# EAGLE design 2 ZEGAR NIXIE (EAGLE 9.2.0)

## Sheet 1 of 2
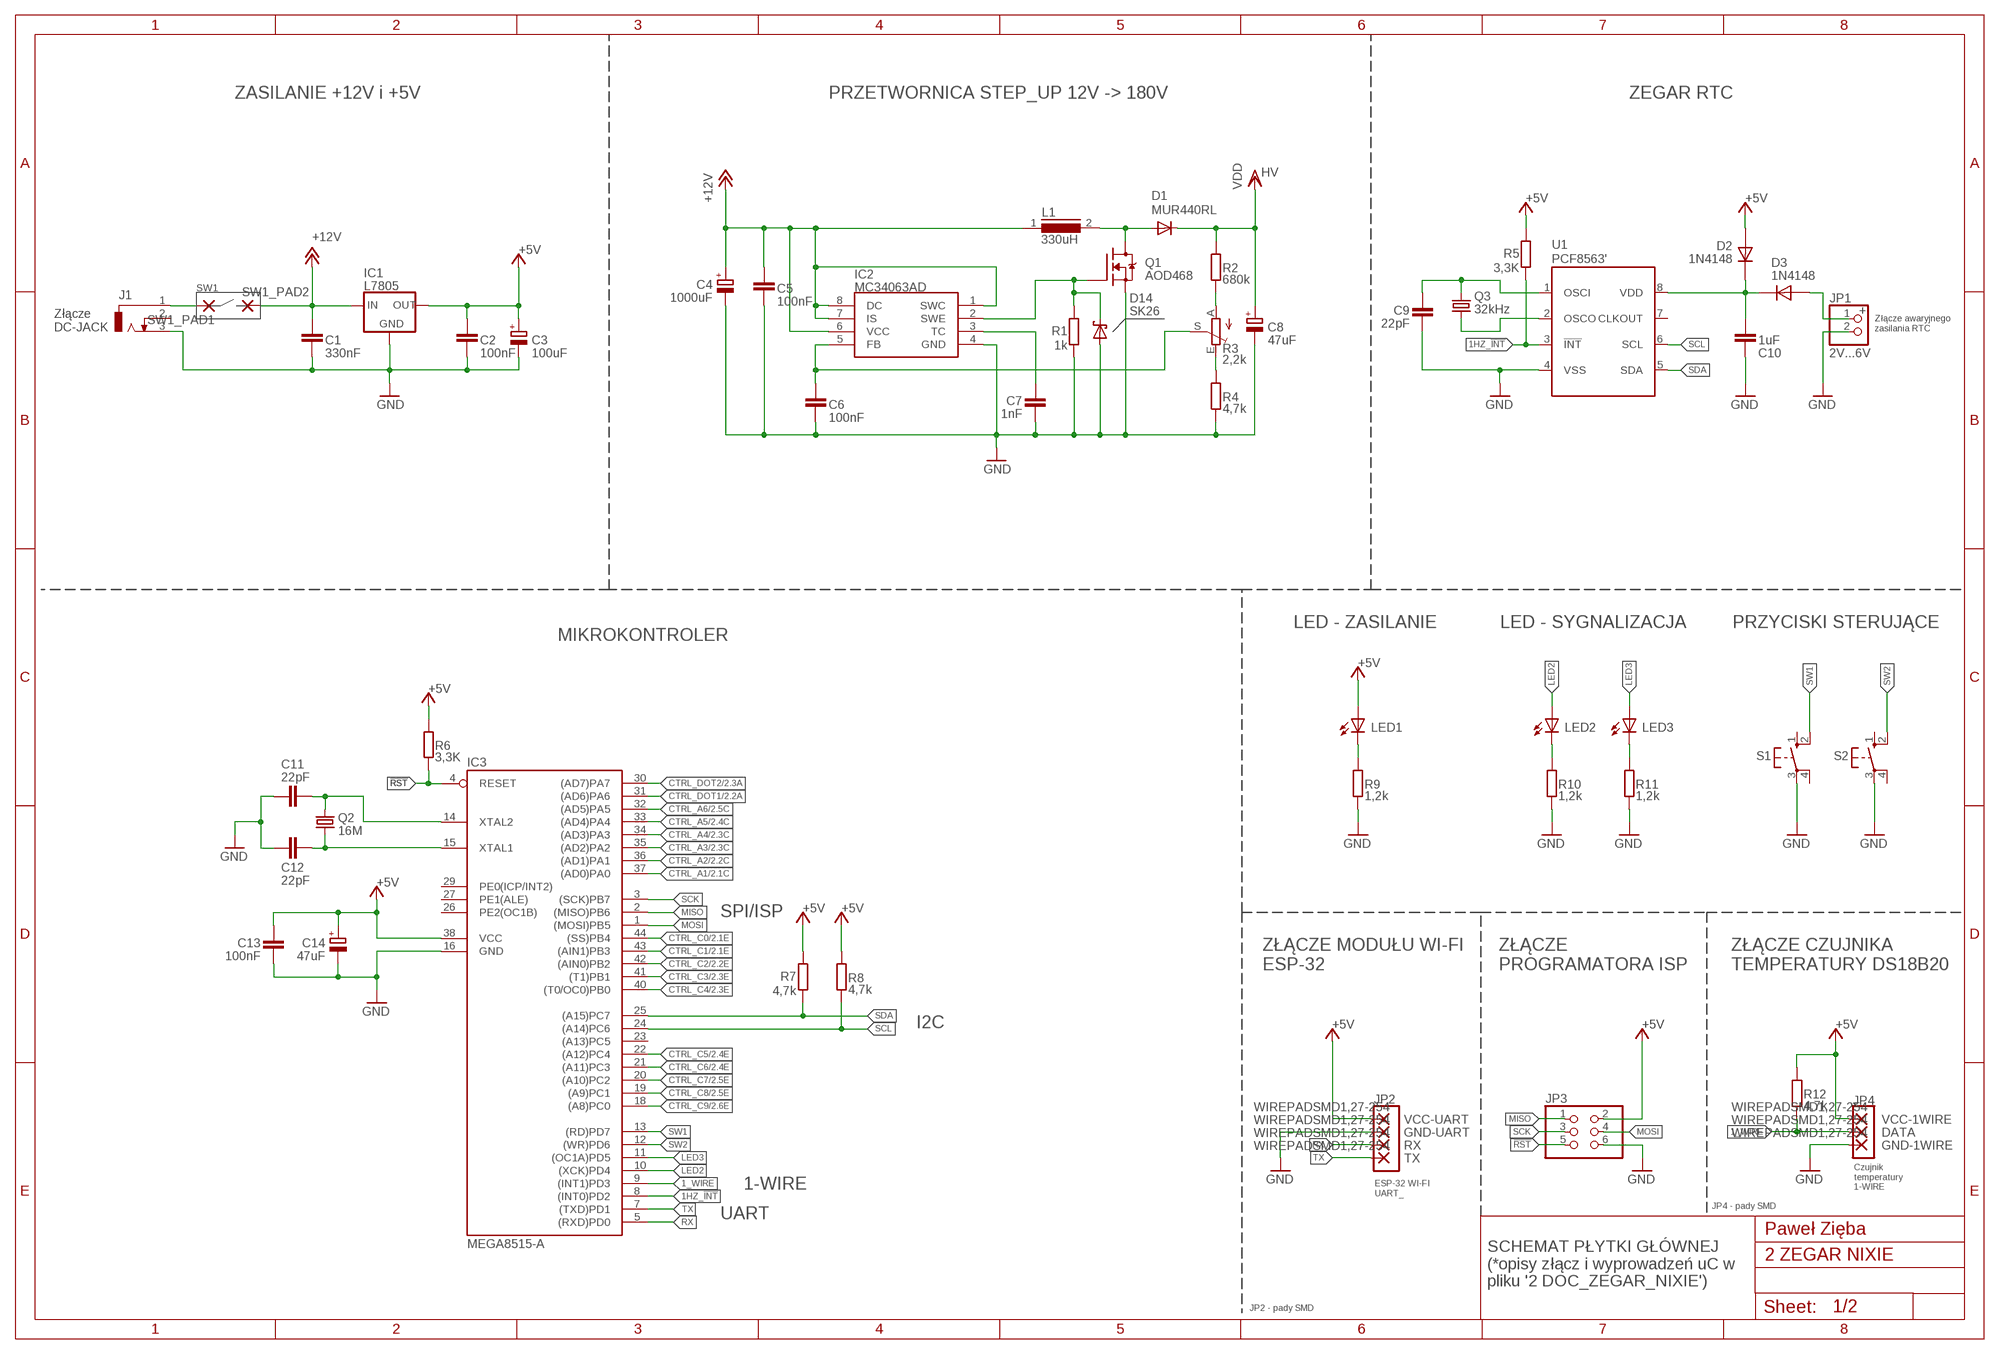
[diagram p0: schematic, sheet 1]

### Parts
C1  330nF  C-EUC1206  [C1206]
C2  100nF  C-EUC1206  [C1206]
C3  100uF  CPOL-EUE5-10.5  [E5-10,5]
C4  1000uF  CPOL-EUE5-10.5  [E5-10,5]
C5  100nF  C-EUC1206  [C1206]
C6  100nF  C-EUC1206  [C1206]
C7  1nF  C-EUC1206  [C1206]
C8  47uF  CPOL-EUE5-13  [E5-13]
C9  22pF  C-EUC1206  [C1206]
C10  1uF  C-EUC1206  [C1206]
C11  22pF  C-EUC1206  [C1206]
C12  22pF  C-EUC1206  [C1206]
C13  100nF  C-EUC1206  [C1206]
C14  47uF  CPOL-EUUD-6,3X8,8  [UD-6,3X5,8_NICHICON]
D1  MUR440RL  [C2673]
D2  1N4148  N14148'  [D1206]
D3  1N4148  N14148'  [D1206]
D14  SK26  SCHOTTKY-DIODESMD  [SMB]
DATA  WIREPADSMD1,27-254  [SMD1,27-2,54]
GND-1WIRE  WIREPADSMD1,27-254  [SMD1,27-2,54]
GND-UART  WIREPADSMD1,27-254  [SMD1,27-2,54]
IC1  L7805  L78-ST'  [DPAK]
IC2  MC34063AD  [SOIC8]
IC3  MEGA8515-A  [TQFP44]
J1  DCJ0303  [DCJ0303]
JP1  2V...6V  PINHD-1X2  [1X02]
JP3  PINHD-2X3  [2X03]
L1  330uH  SFT830D  [SFT830D]
LED1  LED_E  [LED_1206]
LED2  LED_E  [LED_1206]
LED3  LED_E  [LED_1206]
Q1  AOD468  [DPAK-TO252]
Q2  16M  KX-6  [2.5X2.0_KX-6]
Q3  32kHz  CRYSTALTC26H  [TC26H]
R1  1k  R-EU_R0805  [R0805]
R2  680k  R-EU_R0805  [R0805]
R3  2,2k  TRIM_EU-CA6V  [CA6V]
R4  4,7k  R-EU_R0805  [R0805]
R5  3,3K  R-EU_R1206  [R1206]
R6  3,3K  R-EU_R1206  [R1206]
R7  4,7k  R-EU_R1206  [R1206]
R8  4,7k  R-EU_R1206  [R1206]
R9  1,2k  R-EU_R1206  [R1206]
R10  1,2k  R-EU_R1206  [R1206]
R11  1,2k  R-EU_R1206  [R1206]
R12  4,7k  R-EU_R1206  [R1206]
RX  WIREPADSMD1,27-254  [SMD1,27-2,54]
S1  10-XX  [B3F-10XX]
S2  10-XX  [B3F-10XX]
SW1_PAD1  3,81/1,4  [3,81/1,4]
SW1_PAD2  3,81/1,4  [3,81/1,4]
TX  WIREPADSMD1,27-254  [SMD1,27-2,54]
U1  PCF8563'  [SO08-IRF]
VCC-1WIRE  WIREPADSMD1,27-254  [SMD1,27-2,54]
VCC-UART  WIREPADSMD1,27-254  [SMD1,27-2,54]

### Nets
1_WIRE: DATA.1(P) IC3.9((INT1)PD3) R12.1
1HZ_!INT: IC3.8((INT0)PD2) R5.1 U1.3(!INT)
!RST: IC3.4(RESET) JP3.5 R6.1
+5V: C2.1 C3.+ C13.2 C14.+ D2.1(+) IC1.3(OUT) IC3.38(VCC) JP3.2 LED1.A R5.2 R6.2 R7.2 R8.2 R12.2 VCC-1WIRE.1(P) VCC-UART.1(P)
+12V: C1.1 C4.+ C5.1 IC1.1(IN) IC2.1(SWC) IC2.6(VCC) IC2.7(IS) IC2.8(DC) L1.1 SW1_PAD2.1(P)
CTRL_A1: IC3.37((AD0)PA0) ; also sheet 2
CTRL_A2: IC3.36((AD1)PA1) ; also sheet 2
CTRL_A3: IC3.35((AD2)PA2) ; also sheet 2
CTRL_A4: IC3.34((AD3)PA3) ; also sheet 2
CTRL_A5: IC3.33((AD4)PA4) ; also sheet 2
CTRL_A6: IC3.32((AD5)PA5) ; also sheet 2
CTRL_C0: IC3.44((SS)PB4) ; also sheet 2
CTRL_C1: IC3.43((AIN1)PB3) ; also sheet 2
CTRL_C2: IC3.42((AIN0)PB2) ; also sheet 2
CTRL_C3: IC3.41((T1)PB1) ; also sheet 2
CTRL_C4: IC3.40((T0/OC0)PB0) ; also sheet 2
CTRL_C5: IC3.22((A12)PC4) ; also sheet 2
CTRL_C6: IC3.21((A11)PC3) ; also sheet 2
CTRL_C7: IC3.20((A10)PC2) ; also sheet 2
CTRL_C8: IC3.19((A9)PC1) ; also sheet 2
CTRL_C9: IC3.18((A8)PC0) ; also sheet 2
CTRL_DOT1: IC3.31((AD6)PA6) ; also sheet 2
CTRL_DOT2: IC3.30((AD7)PA7) ; also sheet 2
GND: C1.2 C2.2 C3.- C4.- C5.2 C6.2 C7.2 C8.- C9.2 C10.2 C11.1 C12.1 C13.1 C14.- D14.A GND-1WIRE.1(P) GND-UART.1(P) IC1.2(GND) IC2.4(GND) IC3.16(GND) J1.3 JP1.2 JP3.6 Q1.3(S) R1.1 R4.1 R9.1 R10.1 R11.1 S1.3(P) S2.3(P) U1.4(VSS) ; also sheet 2
HV: C8.+ D1.C R2.2 ; supply symbol labelled VDD ; also sheet 2
LED2: IC3.10((XCK)PD4) LED2.A
LED3: IC3.11((OC1A)PD5) LED3.A
MISO: IC3.2((MISO)PB6) JP3.1
MOSI: IC3.1((MOSI)PB5) JP3.4
N$23: J1.1 SW1_PAD1.1(P)
N$24: R2.1 R3.A
N$25: C7.1 IC2.3(TC)
N$26: R3.E R4.2
N$27: C11.2 IC3.14(XTAL2) Q2.3
N$28: D14.C IC2.2(SWE) Q1.1(G) R1.2
N$29: D1.A L1.2 Q1.2(D)
N$30: C6.1 IC2.5(FB) R3.S
N$36: LED1.C R9.2
N$38: C12.2 IC3.15(XTAL1) Q2.1
N$39: Q3.1 U1.2(OSCO)
N$40: C9.1 Q3.2 U1.1(OSCI)
N$41: C10.1 D2.2(-) D3.2(-) U1.8(VDD)
N$42: D3.1(+) JP1.1
N$48: LED2.C R10.2
N$49: LED3.C R11.2
RX: IC3.5((RXD)PD0) RX.1(P)
SCK: IC3.3((SCK)PB7) JP3.3
SCL: IC3.24((A14)PC6) R8.1 U1.6(SCL)
SDA: IC3.25((A15)PC7) R7.1 U1.5(SDA)
SW1: IC3.13((RD)PD7) S1.2(S1)
SW2: IC3.12((WR)PD6) S2.2(S1)
TX: IC3.7((TXD)PD1) TX.1(P)
Unconnected: IC3.6(NC1) IC3.17(NC2) IC3.23((A13)PC5) IC3.26(PE2(OC1B)) IC3.27(PE1(ALE)) IC3.28(NC3) IC3.29(PE0(ICP/INT2)) IC3.39(NC4) J1.2 S1.1(S) S1.4(P1) S2.1(S) S2.4(P1) U1.7(CLKOUT)

### Notes on the sheet
- ZASILANIE +12V i +5V | PRZETWORNICA STEP_UP 12V -> 180V | ZEGAR RTC
- SW1
- +
- Złącze
  DC-JACK
- Złącze awaryjnego
  zasilania RTC
- LED - ZASILANIE | LED - SYGNALIZACJA | PRZYCISKI STERUJĄCE
- MIKROKONTROLER
- SPI/ISP
- ZŁĄCZE MODUŁU WI-FI
  ESP-32
- ZŁĄCZE 
  PROGRAMATORA ISP
- ZŁĄCZE CZUJNIKA 
  TEMPERATURY DS18B20
- I2C
- JP2 | JP4
- 1-WIRE
- Czujnik
  temperatury
  1-WIRE
- ESP-32 WI-FI
  UART_
- JP4 - pady SMD
- UART
- Paweł Zięba
- SCHEMAT PŁYTKI GŁÓWNEJ 
  (*opisy złącz i wyprowadzeń uC w
  pliku '2 DOC_ZEGAR_NIXIE')
- JP2 - pady SMD

## Sheet 2 of 2
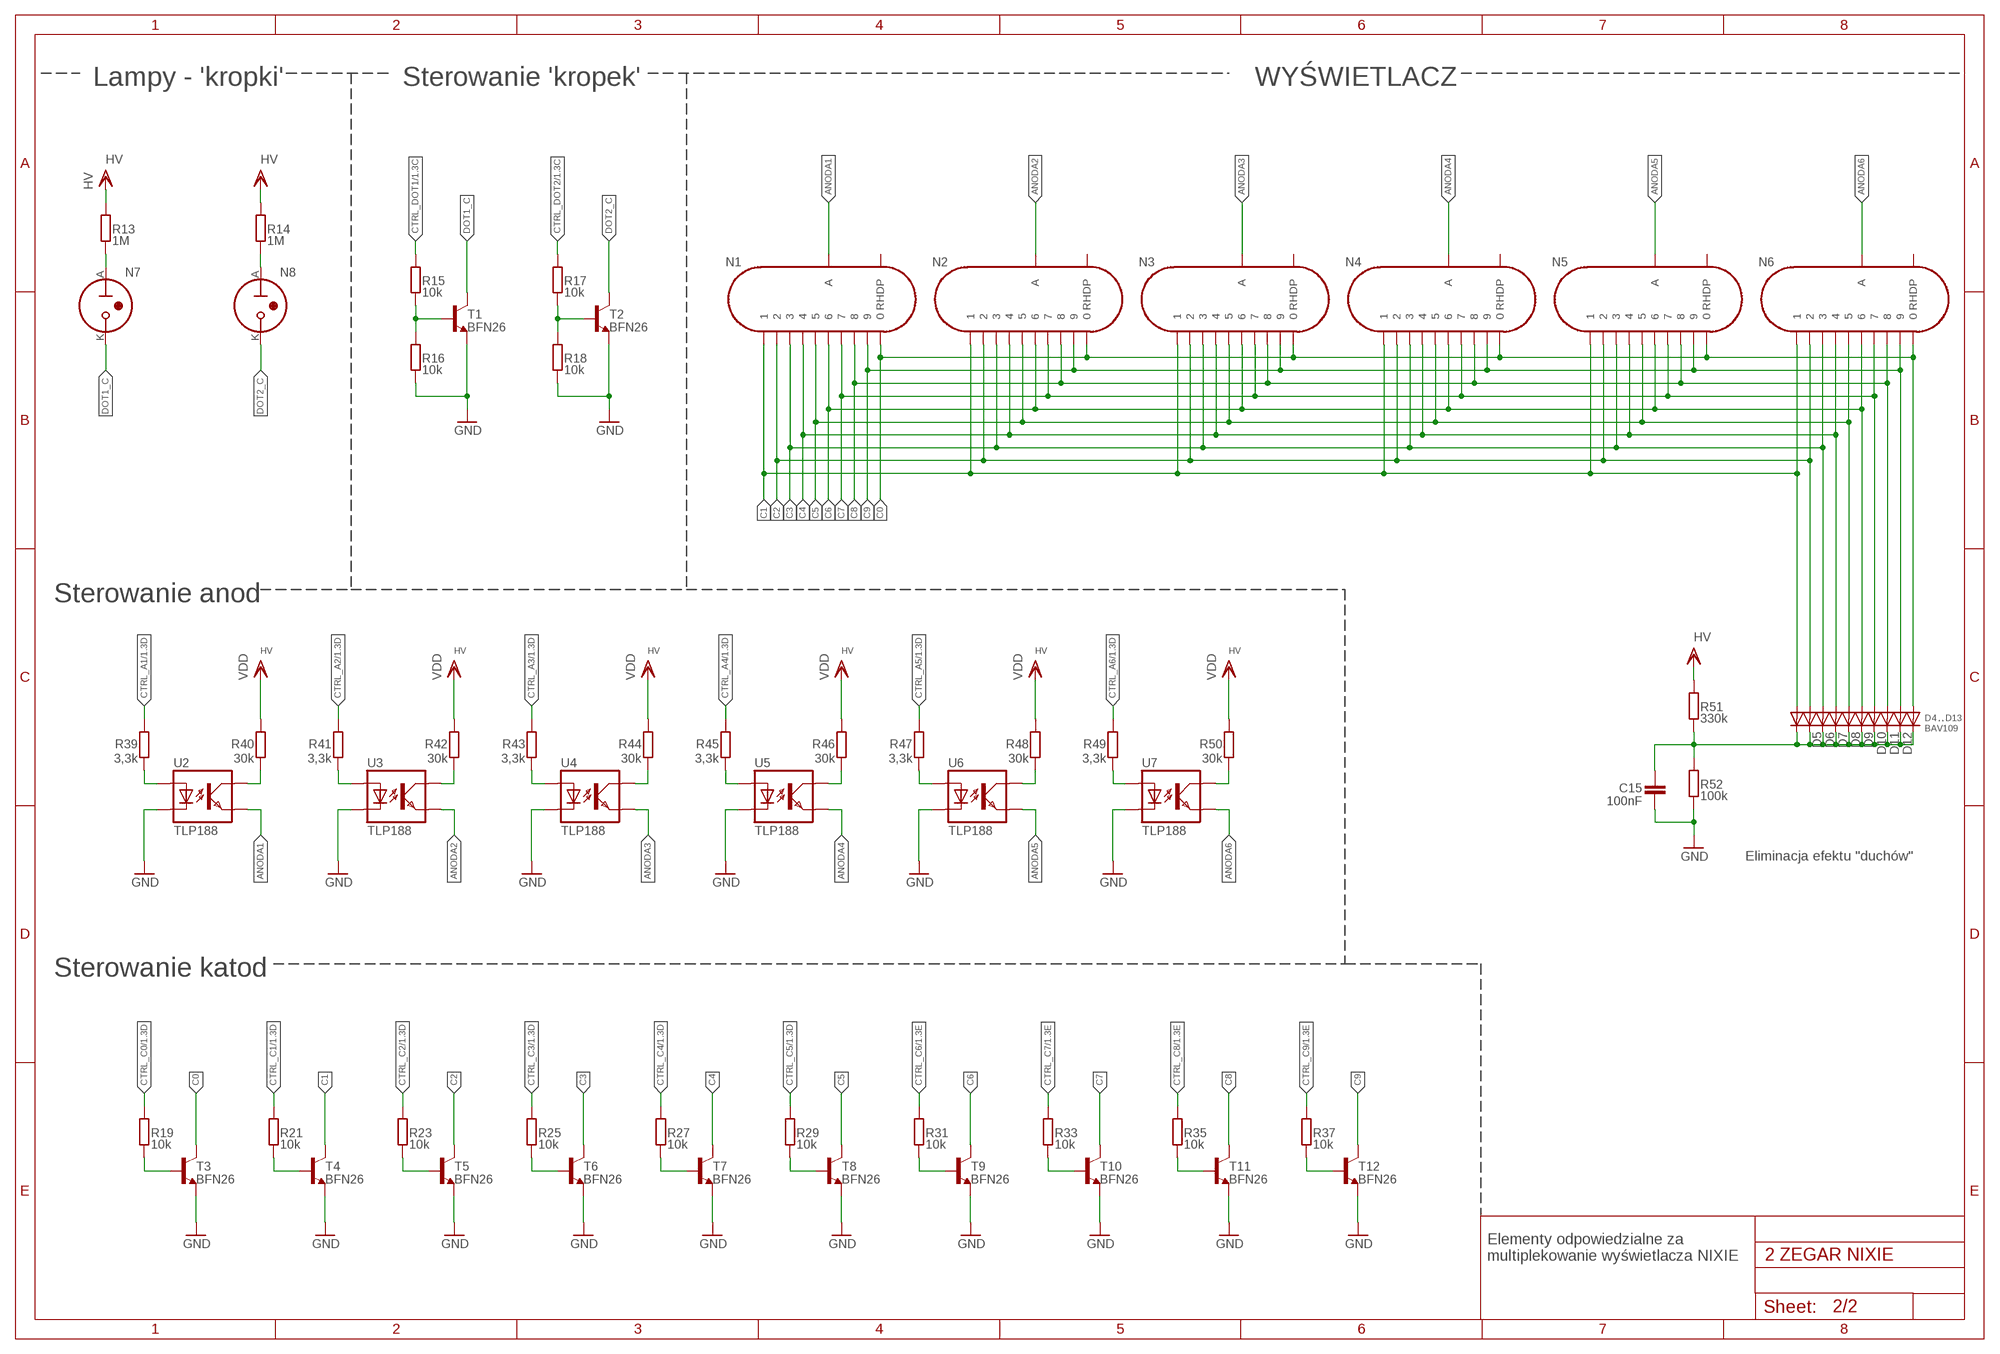
[diagram p1: schematic, sheet 2]

### Parts
C15  100nF  C-EUC1206  [C1206]
D4  DIODE-MINIMELF  [MINIMELF]
D5  DIODE-MINIMELF  [MINIMELF]
D6  DIODE-MINIMELF  [MINIMELF]
D7  DIODE-MINIMELF  [MINIMELF]
D8  DIODE-MINIMELF  [MINIMELF]
D9  DIODE-MINIMELF  [MINIMELF]
D10  DIODE-MINIMELF  [MINIMELF]
D11  DIODE-MINIMELF  [MINIMELF]
D12  DIODE-MINIMELF  [MINIMELF]
D13  BAV109  DIODE-MINIMELF  [MINIMELF]
N1  IN-8-2  [IN-8-2]
N2  IN-8-2  [IN-8-2]
N3  IN-8-2  [IN-8-2]
N4  IN-8-2  [IN-8-2]
N5  IN-8-2  [IN-8-2]
N6  IN-8-2  [IN-8-2]
N7  IN-3  [IN-3]
N8  IN-3  [IN-3]
R13  1M  R-EU_R1206  [R1206]
R14  1M  R-EU_R1206  [R1206]
R15  10k  R-EU_R0805  [R0805]
R16  10k  R-EU_R0805  [R0805]
R17  10k  R-EU_R0805  [R0805]
R18  10k  R-EU_R0805  [R0805]
R19  10k  R-EU_R0805  [R0805]
R21  10k  R-EU_R0805  [R0805]
R23  10k  R-EU_R0805  [R0805]
R25  10k  R-EU_R0805  [R0805]
R27  10k  R-EU_R0805  [R0805]
R29  10k  R-EU_R0805  [R0805]
R31  10k  R-EU_R0805  [R0805]
R33  10k  R-EU_R0805  [R0805]
R35  10k  R-EU_R0805  [R0805]
R37  10k  R-EU_R0805  [R0805]
R39  3,3k  R-EU_R0805  [R0805]
R40  30k  R-EU_R1206  [R1206]
R41  3,3k  R-EU_R0805  [R0805]
R42  30k  R-EU_R1206  [R1206]
R43  3,3k  R-EU_R0805  [R0805]
R44  30k  R-EU_R1206  [R1206]
R45  3,3k  R-EU_R0805  [R0805]
R46  30k  R-EU_R1206  [R1206]
R47  3,3k  R-EU_R0805  [R0805]
R48  30k  R-EU_R1206  [R1206]
R49  3,3k  R-EU_R0805  [R0805]
R50  30k  R-EU_R1206  [R1206]
R51  330k  R-EU_R1206  [R1206]
R52  100k  R-EU_R1206  [R1206]
T1  BFN26  BC850SMD  [SOT23-BEC]
T2  BFN26  BC850SMD  [SOT23-BEC]
T3  BFN26  BC850SMD  [SOT23-BEC]
T4  BFN26  BC850SMD  [SOT23-BEC]
T5  BFN26  BC850SMD  [SOT23-BEC]
T6  BFN26  BC850SMD  [SOT23-BEC]
T7  BFN26  BC850SMD  [SOT23-BEC]
T8  BFN26  BC850SMD  [SOT23-BEC]
T9  BFN26  BC850SMD  [SOT23-BEC]
T10  BFN26  BC850SMD  [SOT23-BEC]
T11  BFN26  BC850SMD  [SOT23-BEC]
T12  BFN26  BC850SMD  [SOT23-BEC]
U2  TLP188  [11-4M1S]
U3  TLP188  [11-4M1S]
U4  TLP188  [11-4M1S]
U5  TLP188  [11-4M1S]
U6  TLP188  [11-4M1S]
U7  TLP188  [11-4M1S]

### Nets
ANODA1: N1.A U2.P$4(EMIT)
ANODA2: N2.A U3.P$4(EMIT)
ANODA3: N3.A U4.P$4(EMIT)
ANODA4: N4.A U5.P$4(EMIT)
ANODA5: N5.A U6.P$4(EMIT)
ANODA6: N6.A U7.P$4(EMIT)
C0: D13.A N1.0 N2.0 N3.0 N4.0 N5.0 N6.0 T3.C
C1: D4.A N1.1 N2.1 N3.1 N4.1 N5.1 N6.1 T4.C
C2: D5.A N1.2 N2.2 N3.2 N4.2 N5.2 N6.2 T5.C
C3: D6.A N1.3 N2.3 N3.3 N4.3 N5.3 N6.3 T6.C
C4: D7.A N1.4 N2.4 N3.4 N4.4 N5.4 N6.4 T7.C
C5: D8.A N1.5 N2.5 N3.5 N4.5 N5.5 N6.5 T8.C
C6: D9.A N1.6 N2.6 N3.6 N4.6 N5.6 N6.6 T9.C
C7: D10.A N1.7 N2.7 N3.7 N4.7 N5.7 N6.7 T10.C
C8: D11.A N1.8 N2.8 N3.8 N4.8 N5.8 N6.8 T11.C
C9: D12.A N1.9 N2.9 N3.9 N4.9 N5.9 N6.9 T12.C
CTRL_A1: R39.1 ; also sheet 1
CTRL_A2: R41.1 ; also sheet 1
CTRL_A3: R43.1 ; also sheet 1
CTRL_A4: R45.1 ; also sheet 1
CTRL_A5: R47.1 ; also sheet 1
CTRL_A6: R49.1 ; also sheet 1
CTRL_C0: R19.2 ; also sheet 1
CTRL_C1: R21.2 ; also sheet 1
CTRL_C2: R23.2 ; also sheet 1
CTRL_C3: R25.2 ; also sheet 1
CTRL_C4: R27.2 ; also sheet 1
CTRL_C5: R29.2 ; also sheet 1
CTRL_C6: R31.2 ; also sheet 1
CTRL_C7: R33.2 ; also sheet 1
CTRL_C8: R35.2 ; also sheet 1
CTRL_C9: R37.2 ; also sheet 1
CTRL_DOT1: R15.2 ; also sheet 1
CTRL_DOT2: R17.2 ; also sheet 1
DOT1_C: N7.K T1.C
DOT2_C: N8.K T2.C
GND: C15.2 R16.1 R18.1 R52.1 T1.E T2.E T3.E T4.E T5.E T6.E T7.E T8.E T9.E T10.E T11.E T12.E U2.P$3(C) U3.P$3(C) U4.P$3(C) U5.P$3(C) U6.P$3(C) U7.P$3(C) ; also sheet 1
HV: R13.2 R14.2 R40.2 R42.2 R44.2 R46.2 R48.2 R50.2 R51.2 ; supply symbol labelled VDD ; also sheet 1
N$37: C15.1 D4.C D5.C D6.C D7.C D8.C D9.C D10.C D11.C D12.C D13.C R51.1 R52.2
N$43: N7.A R13.1
N$44: N8.A R14.1
N$45: R15.1 R16.2 T1.B
N$46: R17.1 R18.2 T2.B
N$47: R40.1 U2.P$6(COL)
N$50: R42.1 U3.P$6(COL)
N$51: R44.1 U4.P$6(COL)
N$52: R46.1 U5.P$6(COL)
N$53: R48.1 U6.P$6(COL)
N$54: R50.1 U7.P$6(COL)
N$55: R39.2 U2.P$1(A)
N$56: R41.2 U3.P$1(A)
N$57: R43.2 U4.P$1(A)
N$58: R49.2 U7.P$1(A)
N$59: R47.2 U6.P$1(A)
N$60: R45.2 U5.P$1(A)
N$61: R19.1 T3.B
N$62: R21.1 T4.B
N$63: R23.1 T5.B
N$64: R25.1 T6.B
N$65: R27.1 T7.B
N$66: R29.1 T8.B
N$67: R31.1 T9.B
N$68: R33.1 T10.B
N$69: R35.1 T11.B
N$70: R37.1 T12.B
Unconnected: N1..(RHDP) N2..(RHDP) N3..(RHDP) N4..(RHDP) N5..(RHDP) N6..(RHDP)

### Notes on the sheet
- Lampy - 'kropki' | Sterowanie 'kropek' | WYŚWIETLACZ
- Sterowanie anod
- ..
- Eliminacja efektu "duchów"
- Sterowanie katod
- Elementy odpowiedzialne za 
  multiplekowanie wyświetlacza NIXIE

## Library data of the parts
C1 C2 C5-C7 C9-C13 C15 = rcl:C-EU: CAPACITOR, European symbol; SPICEPREFIX: C
C3 C4 C8 C14 = rcl:CPOL-EU: POLARIZED CAPACITOR, European symbol; SPICEPREFIX: C
D1 = diode:MUR440RL: DIODE ultra-fast recovery rectifier, Vrrm = 40 V, 4 A
D2 D3 = Diody, mostki:N14148
D4-D13 = diode:DIODE-: DIODE
D14 = diode:SCHOTTKY-DIODE: Schottky Diode
DATA GND-1WIRE GND-UART RX TX VCC-1WIRE VCC-UART = wirepad:WIREPAD: Wire PAD connect wire on PCB
IC1 = stabilizatory_regulatory:L78-ST
IC2 = mc34063:MC34063
IC3 = atmel:MEGA8515: MICROCONTROLLER 8 Kbytes FLASH 512 bytes SRAM 512 bytes EEPROM USART 8-channel 10 bit ADC Source: avr.lbr; MPN: ATMEGA8515-16AU; OC_FARNELL: 9171410; OC_NEWARK: 01M6904
J1 = con-jack:DCJ0303: DC POWER JACK Source: DCJ0303.pdf; OC_FARNELL: unknown; OC_NEWARK: unknown
JP1 = pinhead:PINHD-1X2: PIN HEADER
JP3 = pinhead:PINHD-2X3: PIN HEADER
L1 = inductors:SFT830D: INDUCTOR; SPICEPREFIX: L
LED1-LED3 = eagle-ltspice:LED_E: LED Source: http://www.osram.convergy.de Source: www.luxeon.com Source: www.kingbright.com; SPICEMODEL: NONE; SPICEPREFIX: D; SPICETYPE: diode
N1-N6 = russian-nixies:IN-8-2: IN-8-2: medium numeric frontview nixie tube
N7 N8 = russian-nixies:IN-3: IN-3: nixie bulb
Q1 = tranzystory:AOD468
Q2 = crystal-geyer_V1_0:KX: Quartz Crystals (MHz) SMD: KX - Serie Model Size l/w/h [mm] Frequency Range Frequency Stability Temp. Range [°C] Load Capacitance AECQ 200 availabel Datasheet KX-4 KX-5 KX-6 KX-7 KX-9A KX-9B KX-12A KX-12B KX-13 KX-20 KX-K KX-KS 1.6/1.2/0.3 2.0/1.6/0.45 2.5/2.0/0.55 3.2/2.5/0.8 5.0/3.2/1.0 5.0/3.2/1.1 6.0/3.5/1.1 6.0/3.5/1.0 7.0/5.0 /1.3 11.6/5.5/1.6 12.3/4.5/4.2 12.3/4.5/3.2 24.0 ~ 80.0 MHz 16.0 ~ 80.0 MHz 12.0 ~ 80.0 MHz 8.0 ~ 60.0 MHz 7,68 ~ 300,0 MHz 8,0 ~ 50,0 MHz 8,0 ~ 150,0 MHz 8,0 ~ 50,0 MHz 6,0 ~ 160,0 MHz 3,579 ~ 25,0 MHz 3,579 ~ 70,0 MHz 3,579 ~ 70,0 MHz ±10 … ±50ppm ±10 … ±50ppm ±10 … ±50ppm ±10 … ±50ppm ±10 … ±50ppm ±10 … ±50ppm ±10 … ±50ppm ±10 … ±50ppm ±10 … ±50ppm ±50ppm ±10 … ±50ppm ±10 … ±50ppm (*) -40°C …+85°C (*) -40°C …+125°C (*) -40°C …+125°C (*) -40°C …+125°C (*) -40°C …+105°C (*) -40°C …+105°C (*) -40°C …+125°C (*) -40°C …+105°C (*) -40°C …+105°C (*) -40°C …+105°C (*) -40°C …+85°C (*) -40°C …+85°C 8, 8…16 8, 8…16 10, 8…16 12, 7…20 16, 10…20 16, 10…20 16, 10…20 16, 12…20 16, 12…20 16, 12…20 16, 12…30 16, 12…30 - yes yes yes - - - - - - - - KX-4.pdf <http://www.geyer-electronic.de/uploads/tx_userartikelfrequenz/GEYER-KX-4.pdf> KX-5.pdf <http://www.geyer-electronic.de/uploads/tx_userartikelfrequenz/GEYER-KX-5.pdf> KX-6.pdf <http://www.geyer-electronic.de/uploads/tx_userartikelfrequenz/GEYER-KX-6.pdf> KX-7.pdf <http://www.geyer-electronic.de/uploads/tx_userartikelfrequenz/GEYER-KX-7.pdf> KX-9A.pdf <http://www.geyer-electronic.de/uploads/tx_userartikelfrequenz/GEYER-KX-9A.pdf> KX-9B.pdf <http://www.geyer-electronic.de/uploads/tx_userartikelfrequenz/GEYER-KX-9B.pdf> KX-12A.pdf <http://www.geyer-electronic.de/uploads/tx_userartikelfrequenz/GEYER-KX-12A.pdf> KX-12B.pdf <http://www.geyer-electronic.de/uploads/tx_userartikelfrequenz/GEYER-KX-12B.pdf> KX-13.pdf <http://www.geyer-electronic.de/uploads/tx_userartikelfrequenz/GEYER-KX-13.pdf> KX-20.pdf <http://www.geyer-electronic.de/uploads/tx_userartikelfrequenz/GEYER-KX-20.pdf> KX-K.pdf <http://www.geyer-electronic.de/uploads/tx_userartikelfrequenz/GEYER-KX-K.pdf> KX-KS.pdf <http://www.geyer-electronic.de/uploads/tx_userartikelfrequenz/GEYER-KX-KS.pdf> <http://www.geyer-electronic.de/fileadmin/template/img/logo-geyer-electronic.png> Details see: http://www.geyer-electronic.de/Frequenz-Produkte.9.0.html Created 2016-06-07, Hans Locher 2016 (C) Geyer Quartz Technology KX4,KX5,KX6,KX7,KX9A,KX9B,KX12A,KX12B,KX13,KX20,KXK,KXKS;1612;2016;2520;3225;5032;6035;7050;11655;12345;1,6x1,2;2,0x1,6;2,5x2,0;3,2x2,5;5,0x3,2;6,0x3,5;7,0x5,0;11,6x5,5;12,3x4,5;12,3x4,5;1.6x1.2;2.0x1.6;2.5x2.0;3.2x2.5;5.0x3.2;6.0x3.5;7.0x5.0;11.6x5.5;12.3x4.5;12.3x4.5;
Q3 = crystal:CRYSTAL: CRYSTAL; OC_FARNELL: unknown; OC_NEWARK: unknown
R1 R2 R4-R19 R21 R23 R25 R27 R29 R31 R33 R35 R37 R39-R52 = rcl:R-EU_: RESISTOR, European symbol; SPICEPREFIX: R
R3 = pot:TRIM_EU-: POTENTIOMETER
S1 S2 = switch-omron:10-XX: OMRON SWITCH; MPN: B3F-1000; OC_FARNELL: 176432; OC_NEWARK: 36M3542
SW1_PAD1 SW1_PAD2 = wirepad:3,81/1,4: THROUGH-HOLE PAD
T1-T12 = transistor-npn:BC850*: NPN Transistor
U1 = Układy_scalone:PCF8563
U2-U7 = opto:TLP188

## Board
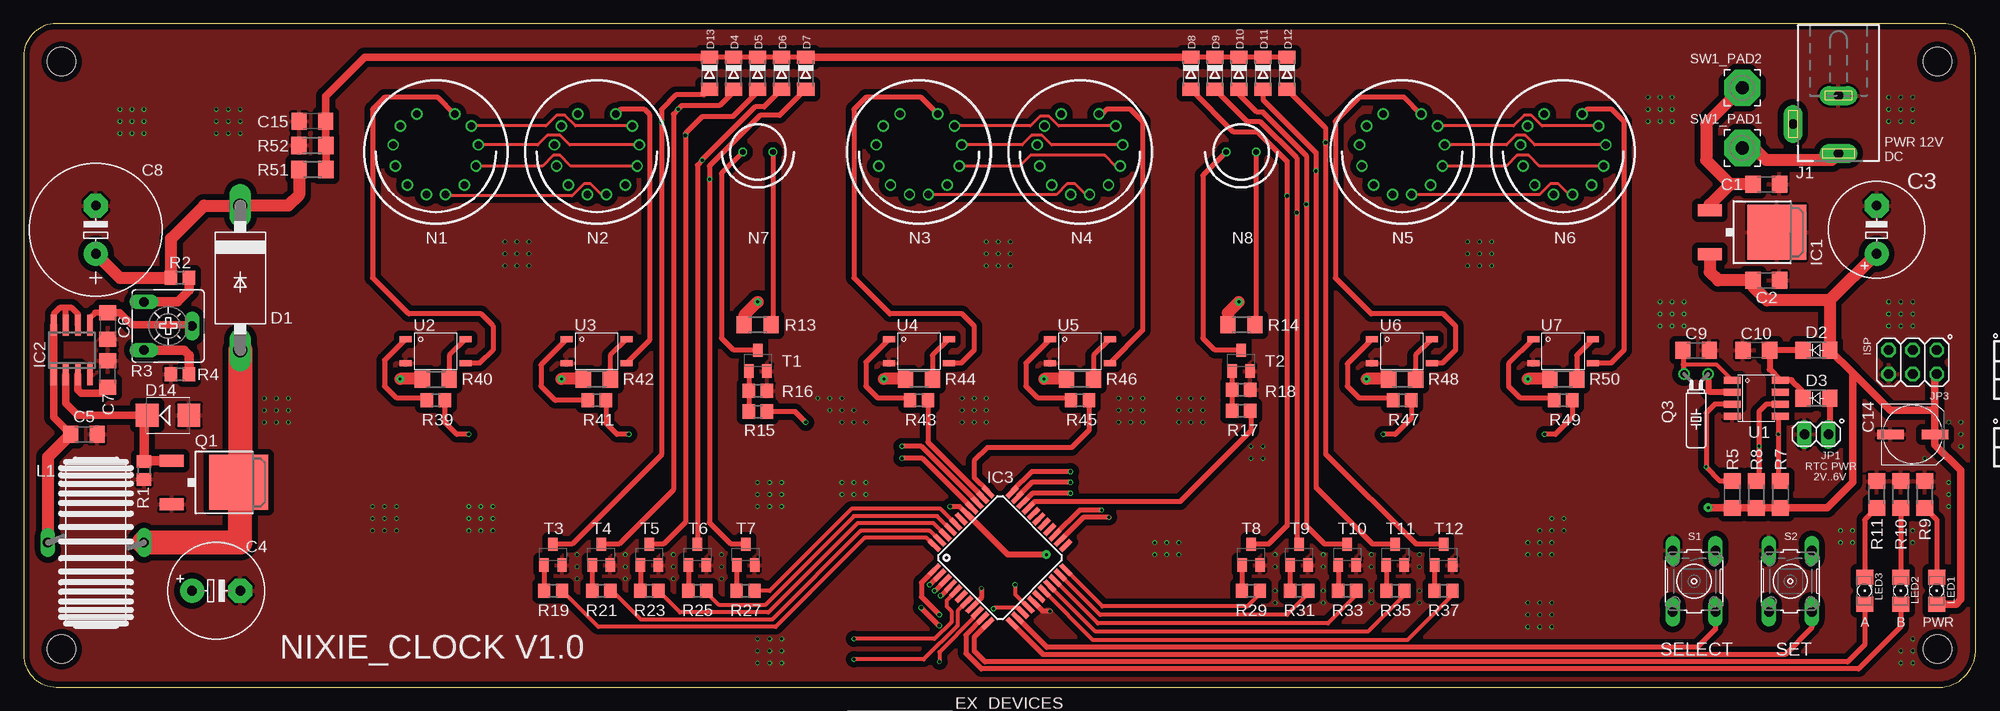
[diagram p2: board, top side]
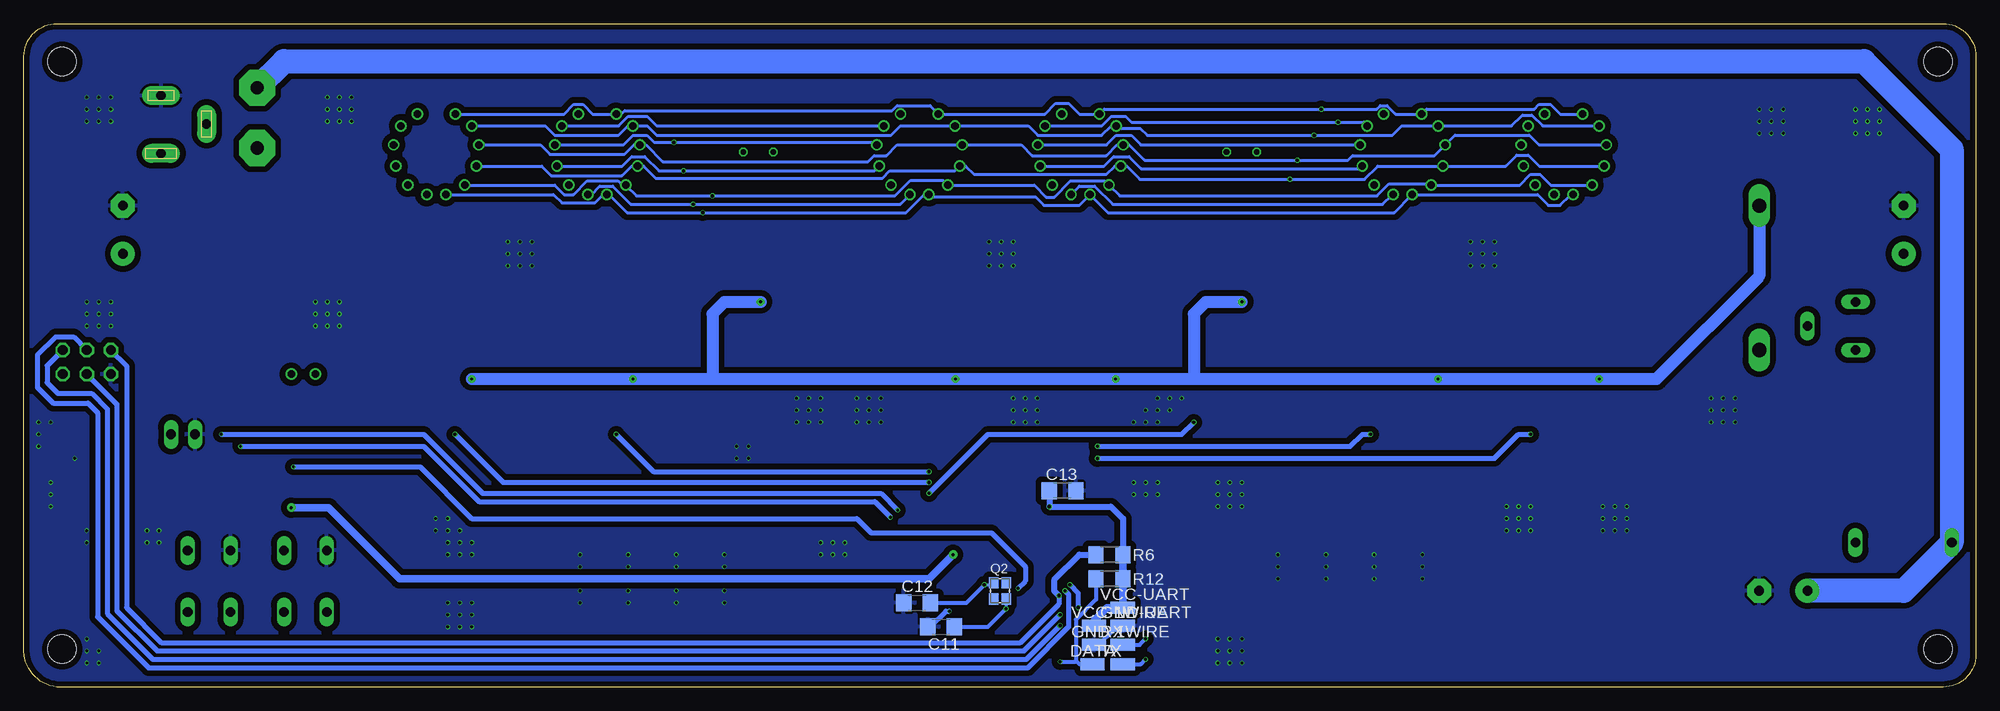
[diagram p3: board, bottom side, seen from below]

Size 206.05 x 70 mm. Coordinates in mm from the lower left corner, seen from the top.
Outline: 0,66.59 0,3.41 arc90 3.41,0 202.57,0 arc90 206.02,4.45 206.02,66.55 arc90 202.57,70 3.41,70 arc90 0,66.59
Copper layers (1*16): Top 0.035559375mm / dielectric 1.6mm / Bottom 0.035559375mm
Design rules "jlcpcb2layer": minimum track width 5mil, minimum drill 12mil, track to track 5mil, track to pad 5mil, pad to pad 5mil, via to via 5mil, smd to smd 5mil, copper to edge 8mil, drill to drill 6mil, minimum pad ring 5mil, minimum via ring 3mil, stop-mask expansion 2.5mil, vias tented up to drill 0mil, thermal gap 10mil
Holes 3 mm at 4,66 4,4 202,4 202,66

### Footprints (pad centres in the part's own frame; a part is rotated, then mirrored left to right if it is on the bottom)
C1206 = smd 1.6 x 1.8: 1 -1.4,0; 2 1.4,0
E5-10,5 = drill 1.016 pad 2.54: + -2.54,0 | drill 1.016 pad 2.54 octagon: - 2.54,0
E5-13 = drill 1.016 pad 2.54: + -2.54,0 | drill 1.016 pad 2.54 octagon: - 2.54,0
UD-6,3X5,8_NICHICON = smd 2.8 x 1: + 2.35,0; - -2.35,0
C2673 = drill 1.499 long: A 7.62,0; C -7.62,0
D1206 = smd 1.6 x 1.803: 1 -1.422,0; 2 1.422,0
MINIMELF = smd 1.4 x 1.8: A 1.7,0; C -1.7,0
SMB = smd 2.4 x 2.4: A 2.2,0; C -2.2,0
SMD1,27-2,54 = smd 1.27 x 2.54: 1 0,0
DPAK = smd 1.27 x 2.54: 1 -2.312,-4.693; 3 2.312,-4.693 | smd 5.8 x 6.2: 2 0,2.38
SOIC8 = smd 0.6 x 2.2: 1 -1.905,-2.6; 2 -0.635,-2.6; 3 0.635,-2.6; 4 1.905,-2.6; 5 1.905,2.6; 6 0.635,2.6; 7 -0.635,2.6; 8 -1.905,2.6
TQFP44 = smd 1.5 x 0.5: 1 -5.8,4; 2 -5.8,3.2; 3 -5.8,2.4; 4 -5.8,1.6; 5 -5.8,0.8; 6 -5.8,0; 7 -5.8,-0.8; 8 -5.8,-1.6; 9 -5.8,-2.4; 10 -5.8,-3.2; 11 -5.8,-4; 23 5.8,-4; 24 5.8,-3.2; 25 5.8,-2.4; 26 5.8,-1.6; 27 5.8,-0.8; 28 5.8,0; 29 5.8,0.8; 30 5.8,1.6; 31 5.8,2.4; 32 5.8,3.2; 33 5.8,4 | smd 0.5 x 1.5: 12 -4,-5.8; 13 -3.2,-5.8; 14 -2.4,-5.8; 15 -1.6,-5.8; 16 -0.8,-5.8; 17 0,-5.8; 18 0.8,-5.8; 19 1.6,-5.8; 20 2.4,-5.8; 21 3.2,-5.8; 22 4,-5.8; 34 4,5.8; 35 3.2,5.8; 36 2.4,5.8; 37 1.6,5.8; 38 0.8,5.8; 39 0,5.8; 40 -0.8,5.8; 41 -1.6,5.8; 42 -2.4,5.8; 43 -3.2,5.8; 44 -4,5.8
DCJ0303 = drill 1 pad 2 long: 1 0,3.1; 2 4.8,0; 3 0,-3
1X02 = drill 1.016 long: 1 -1.27,0; 2 1.27,0
2X03 = drill 1.016 octagon: 1 -2.54,-1.27; 2 -2.54,1.27; 3 0,-1.27; 4 0,1.27; 5 2.54,-1.27; 6 2.54,1.27
SFT830D = drill 1.016 long: 1 -5.08,0; 2 5.08,0
LED_1206 = smd 1.6 x 1.803: A -1.422,0; C 1.422,0
IN-8-2 = drill 0.8: 0 -3.75,-2.75; 1 2,-4; 2 3.75,-2.75; 3 4.5,-0.75; 4 4.25,1.5; 5 3,3.5; 6 1,4.5; 7 -1,4.5; 8 -4.25,1.5; 9 -4.5,-0.75; . -3,3.5; A -2,-4
IN-3 = drill 0.6 octagon: A -1.587,0; K 1.587,0
DPAK-TO252 = smd 1.27 x 2.54: 1 -2.312,-4.693; 3 2.312,-4.693 | smd 5.8 x 6.2: 2 0,2.38
2.5X2.0_KX-6 = smd 1.2 x 1: 1 -0.85,-0.65; 2 0.85,-0.65; 3 0.85,0.65; 4 -0.85,0.65
TC26H = drill 0.813: 1 -1.27,0; 2 1.27,0
R0805 = smd 1.3 x 1.5: 1 -0.95,0; 2 0.95,0
CA6V = drill 1.016 long: A -2.54,-2.54; E 2.54,-2.54; S 0,2.54
R1206 = smd 1.6 x 1.803: 1 -1.422,0; 2 1.422,0
B3F-10XX = drill 1.016 long: 1 -3.251,2.261; 2 3.251,2.261; 3 -3.251,-2.261; 4 3.251,-2.261
3,81/1,4 = drill 1.397 pad 3.81 octagon: 1 0,0
SOT23-BEC = smd 1 x 1.4: B -0.95,-1.1; C 0,1.1; E 0.95,-1.1
SO08-IRF = smd 0.72 x 1.78: 1 -1.905,-2.543; 2 -0.635,-2.543; 3 0.635,-2.543; 4 1.905,-2.543; 5 1.905,2.543; 6 0.635,2.543; 7 -0.635,2.543; 8 -1.905,2.543
11-4M1S = smd 1.27 x 0.635: P$1 -3.175,1.27; P$3 -3.175,-1.27; P$4 3.15,-1.27; P$6 3.15,1.27

### Placement (x,y rotation side)
C1  183.93,53.07 0 top
C2  183.93,42.91 0 top
C3  195.58,48.26 90 top
C4  20.32,10.16 0 top
C5  6.35,26.67 0 top
C6  8.89,38.1 270 top
C7  8.89,33.02 90 top
C8  7.62,48.26 90 top
C9  176.53,35.56 0 top
C10  182.88,35.56 180 top
C11  109.22,6.35 0 bottom
C12  111.76,8.89 0 bottom
C13  96.39,20.7 180 bottom
C14  199.39,26.67 0 top
C15  30.48,59.69 180 top
D1  22.86,43.18 270 top
D2  189.23,35.56 180 top
D3  189.23,30.48 180 top
D4  74.93,64.77 270 top
D5  77.47,64.77 270 top
D6  80.01,64.77 270 top
D7  82.55,64.77 270 top
D8  123.19,64.77 270 top
D9  125.73,64.77 270 top
D10  128.27,64.77 270 top
D11  130.81,64.77 270 top
D12  133.35,64.77 270 top
D13  72.39,64.77 270 top
D14  15.24,28.67 0 top
DATA  93.22,2.41 270 bottom
GND-1WIRE  93.09,4.45 270 bottom
GND-UART  90.04,6.48 270 bottom
IC1  182.66,47.99 270 top
IC2  5.08,35.56 0 top
IC3  103.06,13.65 45 top
J1  191.55,59.42 180 top
JP1  189.23,26.67 180 top
JP3  199.39,34.29 180 top
L1  7.62,15.24 0 top
LED1  201.93,10.16 90 top
LED2  198.12,10.16 90 top
LED3  194.31,10.16 90 top
N1  43.5,56.47 180 top
N2  60.5,56.47 180 top
N3  94.5,56.47 180 top
N4  111.5,56.47 180 top
N5  145.5,56.47 180 top
N6  162.5,56.47 180 top
N7  77.5,56.45 180 top
N8  128.5,56.45 180 top
Q1  20.32,21.59 270 top
Q2  103,10.16 270 bottom
Q3  176.53,33.02 180 top
R1  12.7,22.86 90 top
R2  16.51,43.18 180 top
R3  15.24,38.1 270 top
R4  16.51,33.02 0 top
R5  180.34,20.32 270 top
R6  91.44,13.97 0 bottom
R7  185.42,20.32 270 top
R8  182.88,20.32 270 top
R9  200.66,20.32 270 top
R10  198.12,20.32 270 top
R11  195.58,20.32 270 top
R12  91.44,11.43 0 bottom
R13  77.47,38.23 180 top
R14  128.52,38.23 180 top
R15  77.5,29.07 0 top
R16  77.5,31.27 180 top
R17  128.5,29.17 0 top
R18  128.5,31.37 180 top
R19  55.88,10.16 0 top
R21  60.96,10.16 0 top
R23  66.04,10.16 0 top
R25  71.12,10.16 0 top
R27  76.2,10.16 0 top
R29  129.54,10.16 0 top
R31  134.62,10.16 0 top
R33  139.7,10.16 0 top
R35  144.78,10.16 0 top
R37  149.86,10.16 0 top
R39  43.5,30.27 180 top
R40  43.5,32.47 180 top
R41  60.5,30.25 180 top
R42  60.5,32.49 180 top
R43  94.5,30.25 180 top
R44  94.5,32.49 180 top
R45  111.5,30.25 180 top
R46  111.5,32.49 180 top
R47  145.5,30.25 180 top
R48  145.5,32.49 180 top
R49  162.5,30.27 180 top
R50  162.5,32.49 180 top
R51  30.48,54.61 180 top
R52  30.48,57.15 0 top
RX  90.04,4.45 270 bottom
S1  176.31,11.16 270 top
S2  186.47,11.16 270 top
SW1_PAD1  181.39,56.88 0 top
SW1_PAD2  181.39,63.23 0 top
T1  77.5,34.45 0 top
T2  128.5,34.45 0 top
T3  55.88,13.97 0 top
T4  60.96,13.97 0 top
T5  66.04,13.97 0 top
T6  71.12,13.97 0 top
T7  76.2,13.97 0 top
T8  129.54,13.97 0 top
T9  134.62,13.97 0 top
T10  139.7,13.97 0 top
T11  144.78,13.97 0 top
T12  149.86,13.97 0 top
TX  90.04,2.41 270 bottom
U1  182.88,30.48 270 top
U2  43.5,35.45 0 top
U3  60.5,35.45 0 top
U4  94.5,35.45 0 top
U5  111.5,35.45 0 top
U6  145.5,35.45 0 top
U7  162.5,35.45 0 top
VCC-1WIRE  93.09,6.48 270 bottom
VCC-UART  90.04,8.38 270 bottom

### Tracks (layer width: path | path; a pad name or v marks a point on that pad's centre or on a via)
1_WIRE  (via drill 0.3)
  Top 0.406: v96.65,2.67 96.65,3.68 100.28,7.31 100.28,7.47 IC3.9
  Bottom 0.406: R12.1 92.86,9.25 95,7.11 95,2.79 | DATA.1 94.61,2.41 95,2.79 | v96.65,2.67 95.12,2.67 95,2.79
1HZ_!INT  (via drill 0.3)
  Top 0.508: U1.3 178.49,29.84 177.58,28.94 v177.58,23.23 179.07,21.74 R5.1 | IC3.8 101.09,9.42 v101.09,10.41
  Bottom 0.508: v177.58,23.23 164.2,23.23 158.75,17.78 118.11,17.78 116.59,16.26 103.89,16.26 100.33,12.7 100.33,11.18 v101.09,10.41
!RST  (via drill 0.35)
  Top 0.508: IC3.4 96.8,9.65 v96.77,9.65
  Bottom 0.508: JP3.5 195.2,33.91 195.2,8.38 191.52,4.7 100.84,4.7 96.77,8.76 v96.77,9.65
  Bottom 0.61: R6.1 94.61,13.97 97.28,11.3 97.28,10.16 v96.77,9.65
+5V  (via drill 0.3 pad 0.9, 0.35)
  Top 0.508: v97.79,19.05 98.79,19.05 IC3.38
  Top 0.61: IC3.38 103.87,13.97 v107.95,13.97
  Top 0.813: 193.04,33.17 D2.1 | 193.04,33.17 193.04,21.59 190.35,18.9 R7.2 R8.2 R5.2 180.31,18.92 v177.8,18.92 | JP3.2 201.74,32.83 201.74,29.21 | 201.74,29.21 C14.+ 201.74,25.59 204.47,22.86 204.47,9.27 203.96,8.76 201.96,8.76 LED1.A | 193.04,33.17 197,29.21 201.74,29.21
  Top 1.27: IC1.3 177.97,43.79 178.85,42.91 C2.1 182.53,42.26 184,40.79 190.65,40.79 | 190.65,40.79 D2.1 | C3.+ 190.65,40.79
  Bottom 0.61: R6.2 90.02,17.78 91.29,19.05 v97.79,19.05 C13.2
  Bottom 0.813: v177.8,18.92 173.86,18.92 166.37,11.43 110.49,11.43 v107.95,13.97 | R6.2 R12.2 90.04,11.4 VCC-UART.1 91.69,8.38 93.09,6.99 VCC-1WIRE.1
+12V
  Top 0.61: IC2.6 5.71,39.37 5.08,40.01 4.45,40.01 | IC2.8 3.17,39.37 3.81,40.01 4.45,40.01 | IC2.7 4.45,40.01
  Top 0.813: IC2.8 IC2.1 3.17,28.45 C5.1
  Top 1.27: SW1_PAD2.1 177.58,59.42 177.58,55.61 180.12,53.07 | C1.1 180.12,53.07 | 180.12,53.07 177.97,50.92 IC1.1 | L1.1 2.54,24.26 C5.1
  Bottom 2.54: SW1_PAD2.1 178.58,66.04 11.81,66.04 2.54,56.77 L1.1 7.62,10.16 C4.+
ANODA1
  Top 0.508: N1.A 43.74,62.23 38.1,62.23 36.83,60.96 36.83,43.18 40.64,39.37 48.26,39.37 49.53,38.1 49.53,35.56 48.15,34.18 U2.P$4
ANODA2
  Top 0.508: N2.A 62.99,60.96 65.53,60.96 66.04,60.45 66.04,36.57 U3.P$4
ANODA3
  Top 0.508: N3.A 94.74,62.23 88.9,62.23 87.63,60.96 87.63,43.18 91.44,39.37 99.06,39.37 100.33,38.1 100.33,35.56 98.95,34.18 U4.P$4
ANODA4
  Top 0.508: N4.A 113.81,60.47 114.3,60.96 116.84,60.96 118.11,59.69 118.11,37.64 U5.P$4
ANODA5
  Top 0.508: N5.A 145.74,62.23 140.97,62.23 138.43,59.69 138.43,43.18 142.24,39.37 149.86,39.37 151.13,38.1 151.13,35.56 149.75,34.18 U6.P$4
ANODA6
  Top 0.508: N6.A 164.99,60.96 167.64,60.96 168.91,59.69 168.91,35.56 167.53,34.18 U7.P$4
C0  (via drill 0.35)
  Top 0.305: N2.0 58.25,59.22 57.11,60.35 56.26,60.35 55.12,59.22 N1.0 | N3.0 106.25,59.22 107.26,60.23 108.24,60.23 109.25,59.22 N4.0 | N5.0 157.25,59.22 158.39,60.35 159.11,60.35 160.25,59.22 N6.0
  Top 0.508: D13.A 71.8,62.48 68.83,62.48 67.31,60.96 v67.31,59.6 67.31,24.51 57.87,15.07 T3.C
  Bottom 0.305: N2.0 64.63,59.6 v67.31,59.6 89.12,59.6 89.75,60.23 91.24,60.23 92.25,59.22 N3.0 | N4.0 139.24,59.22 140.24,60.23 142.24,60.23 143.25,59.22 N5.0
C1  (via drill 0.35)
  Top 0.508: D4.A 74.93,62.84 73.44,61.34 69.45,61.34 v69.09,60.98 68.58,60.47 68.58,20.83 62.82,15.07 T4.C
  Bottom 0.305: N1.1 43.88,60.47 44.88,61.48 46.12,61.48 46.62,60.98 57.99,60.98 N2.1 61.26,60.47 62.14,61.35 62.86,61.35 63.24,60.98 v69.09,60.98 91.99,60.98 N3.1 94.62,60.47 95.75,61.6 97.12,61.6 98.25,60.47 N4.1 110.38,61.35 113.86,61.35 114.38,60.83 142.62,60.83 142.98,60.47 N5.1 146,60.47 147.01,61.48 147.99,61.48 149,60.47 N6.1
C2  (via drill 0.35)
  Top 0.508: D5.A 77.47,62.84 74.83,60.2 71.63,60.2 69.85,58.42 v69.85,58.21 69.85,17.4 67.52,15.07 T5.C
  Bottom 0.305: N1.2 45.72,59.22 46.86,60.36 47.86,60.36 49,59.22 N2.2 60.59,59.22 61.6,58.21 v69.85,58.21 87.46,58.21 88.21,58.97 90.5,58.97 N3.2 91.26,59.22 92.26,58.21 99,58.21 100,59.22 N4.2 113.5,59.22 114.5,58.21 139.22,58.21 140.23,59.22 N5.2 142.26,59.22 143.26,58.21 150,58.21 151,59.22 N6.2
C3  (via drill 0.35)
  Top 0.508: D6.A 78.17,61.23 77.22,61.23 71.63,55.64 v71.63,55.59 71.12,55.09 T6.C
  Bottom 0.305: N1.3 46.11,57.22 47.13,58.24 54.98,58.24 N2.3 57.14,56.08 65.79,56.08 66.27,55.59 v71.63,55.59 87.74,55.59 89.37,57.22 N3.3 90.63,57.22 91.77,56.09 99.62,56.09 100.75,57.22 N4.3 113.86,57.22 115,56.08 116.27,56.08 116.91,55.44 138.59,55.44 140.37,57.22 N5.3 141.63,57.22 142.64,56.21 150.49,56.21 151.5,57.22 N6.3
C4  (via drill 0.35)
  Top 0.508: D7.A 79.81,60.33 77.72,60.33 72.39,54.99 v72.39,53.58 72.39,17.36 74.68,15.07 T7.C
  Bottom 0.305: N6.4 151.38,54.97 150.37,53.96 142.89,53.96 141.88,54.97 N5.4 140.62,54.97 139.36,53.71 115.39,53.71 114.63,54.46 107.76,54.46 N4.4 106.62,54.97 105.74,54.09 91.76,54.09 90.88,54.97 N3.4 89.62,54.97 88.23,53.58 v72.39,53.58 64.51,53.58 63.12,54.97 N2.4 49.63,54.97 48.47,56.13 47.24,56.13 46.08,54.97 N1.4
C5  (via drill 0.35)
  Top 0.508: D8.A 127.71,58.55 130.3,58.55 133.35,55.5 v133.35,51.83 133.35,17.02 131.4,15.07 T8.C
  Bottom 0.305: N1.5 44.88,52.97 46.01,54.1 46.99,54.1 48.12,52.97 N2.5 57.63,53.1 61.95,53.1 63.22,51.83 90.36,51.83 N3.5 91.94,53.41 95.56,53.41 97.26,51.71 98.12,51.71 99.38,52.97 N4.5 109.01,53.48 112.44,53.48 114.09,51.83 v133.35,51.83 141.36,51.83 N5.5 142.88,52.97 143.32,53.41 146.56,53.41 148.01,51.96 148.99,51.96 150,52.97 N6.5
C6  (via drill 0.35)
  Top 0.508: D9.A 129.16,59.64 130.56,59.64 134.37,55.83 v134.37,50.08 134.37,15.32 T9.C
  Bottom 0.305: N1.6 42.75,51.97 43.88,50.84 45.12,50.84 46.25,51.97 N2.6 61.39,50.08 91.61,50.08 N3.6 94.63,50.84 98.36,50.84 99.24,51.72 110.25,51.72 N4.6 111,51.97 112.9,50.08 v134.37,50.08 142.35,50.08 144.25,51.97 N5.6 144.88,51.97 145.76,51.09 149.24,51.09 150.12,51.97 N6.6
C7  (via drill 0.35)
  Top 0.305: N1.7 44.63,51.84 57.88,51.84 59.14,53.1 59.86,53.1 61,51.97 N2.7 | N3.7 109,51.97 110.14,53.1 110.99,53.1 112.12,51.97 N4.7 | N6.7 163.12,51.97 161.99,53.1 161.14,53.1 160,51.97 N5.7
  Top 0.508: D10.A 128.27,62.56 130.18,60.66 130.81,60.66 135.38,56.09 v135.38,50.95 135.38,17.02 137.33,15.07 T10.C
  Bottom 0.305: N3.7 94.62,52.85 93.01,52.85 91.09,50.93 62.62,50.93 61.57,51.97 N2.7 | N4.7 113.52,50.95 v135.38,50.95 141.99,50.95 143.88,52.85 145.25,52.85 146.12,51.97 N5.7
C8  (via drill 0.35)
  Top 0.305: N2.8 57.75,54.97 56.61,56.1 55.89,56.1 54.75,54.97 N1.8 | N4.8 115.24,54.97 114.11,56.1 106.25,56.1 105.12,54.97 N3.8 | N5.8 156.5,54.97 157.63,56.1 158.87,56.1 160,54.97 N6.8
  Top 0.508: D11.A 130.81,61.98 136.4,56.39 v136.4,54.46 136.4,21.08 142.41,15.07 T11.C
  Bottom 0.305: N2.8 65,54.72 88.12,54.72 89.38,55.98 91,55.98 92,54.97 N3.8 | N4.8 116.26,54.46 v136.4,54.46 138.99,54.46 140.5,55.98 141.87,55.98 142.88,54.97 N5.8
C9  (via drill 0.35)
  Top 0.305: N1.9 54.25,57.22 55.26,58.23 56.62,58.23 57.62,57.22 N2.9 | N4.9 108.5,57.22 107.49,58.23 106.38,58.23 105.38,57.22 N3.9 | N6.9 159.5,57.22 158.49,58.23 157.51,58.23 156.5,57.22 N5.9
  Top 0.508: D12.A 137.41,59.01 v137.41,57.47 137.41,24.64 146.98,15.07 T12.C
  Bottom 0.305: N2.9 88.12,57.22 89.13,58.23 90.75,58.23 91.75,57.22 N3.9 | N4.9 116.25,57.47 v137.41,57.47 139.5,57.47 140.25,58.23 141.75,58.23 142.75,57.22 N5.9
CTRL_A1  (via drill 0.35)
  Top 0.508: R39.1 44.45,27.94 45.72,26.67 v46.99,26.67 | v92.71,24.13 94.87,24.13 100.09,18.91 IC3.37
  Bottom 0.508: v46.99,26.67 48.26,26.67 50.8,24.13 v92.71,24.13
CTRL_A2  (via drill 0.35)
  Top 0.508: R41.1 61.45,27.83 62.61,26.67 v63.88,26.67 | v92.71,25.4 94.74,25.4 100.66,19.49 IC3.36
  Bottom 0.508: v63.88,26.67 64.77,26.67 66.04,25.4 v92.71,25.4
CTRL_A3
  Top 0.508: R43.1 95.45,25.84 101.22,20.06 IC3.35
CTRL_A4
  Top 0.508: R45.1 112.45,27.11 110.62,25.27 101.73,25.27 100.33,23.88 100.33,22.1 101.79,20.64 IC3.34
CTRL_A5  (via drill 0.35)
  Top 0.508: R47.1 146.45,28.34 144.78,26.67 v143.51,26.67 | v110.49,22.73 106.43,22.73 104.33,20.64 IC3.33
  Bottom 0.508: v143.51,26.67 139.57,22.73 v110.49,22.73
CTRL_A6  (via drill 0.35)
  Top 0.508: v110.49,21.59 106.43,21.59 104.9,20.06 IC3.32 | R49.1 163.45,28.45 161.67,26.67 v160.53,26.67
  Bottom 0.508: v110.49,21.59 155.45,21.59 v160.53,26.67
CTRL_C0
  Top 0.406: IC3.44 95.31,15.75 88.77,15.75 79.38,6.35 60.64,6.35 R19.2
CTRL_C1
  Top 0.406: IC3.43 96.64,15.49 95.66,16.47 88.35,16.47 78.99,7.11 65.15,7.11 62.1,10.16 R21.2
CTRL_C2
  Top 0.406: R23.2 69.28,7.87 78.61,7.87 88.03,17.29 96.03,17.29 IC3.42
CTRL_C3
  Top 0.406: IC3.41 96.41,18.03 87.63,18.03 78.23,8.64 73.41,8.64 72.07,9.97 R25.2
CTRL_C4
  Top 0.406: R27.2 78.74,10.16 87.38,18.8 96.78,18.8 IC3.40
CTRL_C5
  Top 0.406: IC3.22 113.86,8.51 129.16,8.51 130.81,10.16 R29.2
CTRL_C6
  Top 0.406: IC3.21 113.61,7.62 133.35,7.62 135.57,9.84 R31.2
CTRL_C7
  Top 0.406: IC3.20 113.37,6.73 137.67,6.73 140.59,9.65 140.59,10.1 R33.2
CTRL_C8
  Top 0.406: IC3.19 113.13,5.84 141.86,5.84 145.67,9.65 145.67,10.1 R35.2
CTRL_C9
  Top 0.406: IC3.18 112.89,4.95 146.05,4.95 150.75,9.65 150.75,10.1 R37.2
CTRL_DOT1  (via drill 0.35)
  Top 0.508: R15.2 81.42,29.07 v82.55,27.94 | IC3.31 106.46,20.45 v110.49,20.45
  Bottom 0.508: v82.55,27.94 83.82,26.67 104.27,26.67 v110.49,20.45
CTRL_DOT2
  Top 0.508: R17.2 129.54,29.08 129.54,27.05 122.05,19.56 106.7,19.56 IC3.30
DOT1_C
  Top 0.508: N7.K 73.66,54.2 73.66,36.83 74.94,35.55 T1.C
DOT2_C
  Top 0.508: N8.K 124.46,54 124.46,36.83 125.74,35.55 T2.C
GND  (via drill 0.3)
  Top 0.508: IC3.16 107.58,8 v108.33,8
  Bottom 0.406: GND-UART.1 90.42,6.1 90.93,6.1 92.58,4.45 GND-1WIRE.1
  Bottom 0.508: v108.33,8 108.71,8 110.36,6.35 C11.1
  other vias: 171.45,62.23 172.72,62.23 173.99,62.23 173.99,60.96 173.99,59.69 172.72,59.69 172.72,60.96 171.45,60.96 171.45,59.69 172.72,40.64 175.26,40.64 173.99,40.64 173.99,39.37 172.72,39.37 172.72,38.1 173.99,38.1 175.26,38.1 175.26,39.37 196.85,62.23 198.12,62.23 199.39,62.23 199.39,60.96 198.12,60.96 196.85,60.96 196.85,59.69 198.12,59.69 199.39,59.69 199.39,40.64 199.39,39.37 199.39,38.1 198.12,38.1 196.85,38.1 196.85,39.37 198.12,39.37 198.12,40.64 196.85,40.64 10.16,60.96 11.43,60.96 12.7,60.96 12.7,59.69 12.7,58.42 11.43,58.42 10.16,58.42 10.16,59.69 11.43,59.69 20.32,60.96 21.59,60.96 22.86,60.96 22.86,59.69 21.59,59.69 20.32,59.69 20.32,58.42 21.59,58.42 22.86,58.42 25.4,30.48 26.67,30.48 27.94,30.48 27.94,29.21 27.94,27.94 26.67,27.94 25.4,27.94 25.4,29.21 26.67,29.21 36.83,19.05 39.37,19.05 38.1,19.05 38.1,17.78 36.83,17.78 36.83,16.51 38.1,16.51 39.37,16.51 39.37,17.78 46.99,19.05 46.99,17.78 46.99,16.51 48.26,16.51 49.53,16.51 49.53,17.78 48.26,17.78 48.26,19.05 49.53,19.05 119.38,15.24 120.65,15.24 121.92,15.24 121.92,13.97 120.65,13.97 119.38,13.97 129.54,24.13 130.81,24.13 130.81,25.4 129.54,25.4 115.57,30.48 116.84,30.48 118.11,30.48 118.11,29.21 116.84,29.21 115.57,29.21 115.57,27.94 116.84,27.94 118.11,27.94 121.92,30.48 123.19,30.48 124.46,30.48 124.46,29.21 123.19,29.21 121.92,29.21 121.92,27.94 123.19,27.94 124.46,27.94 99.06,30.48 100.33,30.48 101.6,30.48 101.6,29.21 100.33,29.21 99.06,29.21 99.06,27.94 100.33,27.94 101.6,27.94 77.47,21.59 78.74,21.59 80.01,21.59 80.01,20.32 78.74,20.32 77.47,20.32 77.47,19.05 78.74,19.05 80.01,19.05 86.36,21.59 87.63,21.59 88.9,21.59 88.9,20.32 87.63,20.32 86.36,20.32 83.82,30.48 85.09,30.48 86.36,30.48 85.09,29.21 86.36,29.21 87.63,29.21 86.36,27.94 87.63,27.94 88.9,27.94 158.75,15.24 160.02,15.24 161.29,15.24 161.29,13.97 160.02,13.97 158.75,13.97 160.02,16.51 161.29,16.51 162.56,16.51 161.29,17.78 162.56,17.78 158.75,8.89 160.02,8.89 161.29,8.89 158.75,7.62 160.02,7.62 161.29,7.62 158.75,6.35 160.02,6.35 161.29,6.35 193.04,16.51 199.39,16.51 193.04,15.24 199.39,15.24 198.12,2.54 199.39,2.54 199.39,3.81 198.12,3.81 152.4,46.99 153.67,46.99 154.94,46.99 154.94,45.72 153.67,45.72 152.4,45.72 152.4,44.45 153.67,44.45 154.94,44.45 101.6,46.99 102.87,46.99 104.14,46.99 104.14,45.72 102.87,45.72 101.6,45.72 101.6,44.45 102.87,44.45 104.14,44.45 50.8,46.99 52.07,46.99 53.34,46.99 53.34,45.72 52.07,45.72 50.8,45.72 50.8,44.45 52.07,44.45 53.34,44.45 203.2,27.94 204.47,27.94 204.47,26.67 77.47,5.08 78.74,5.08 80.01,5.08 80.01,3.81 80.01,2.54 78.74,2.54 77.47,2.54 77.47,3.81 78.74,3.81 132.08,13.97 132.08,12.7 132.08,10.16 132.08,8.89 137.16,13.97 137.16,12.7 137.16,10.16 137.16,8.89 142.24,13.97 142.24,12.7 142.24,10.16 142.24,8.89 147.32,13.97 147.32,12.7 147.32,10.16 147.32,8.89 73.66,12.7 73.66,13.97 68.58,13.97 68.58,12.7 63.5,13.97 63.5,12.7 58.42,13.97 58.42,12.7 73.66,11.43 68.58,11.43 63.5,11.43 58.42,11.43 203.2,19.05 203.2,20.32 203.2,21.59 200.66,24.13 204.47,25.4 191.77,16.51 191.77,15.24 199.39,5.08
  pour Top (isolate 0.61): 0,3.41 0,66.59 arc-90 3.41,70 202.59,70 arc-90 206,66.59 206,3.41 arc-90 202.59,0 3.41,0 arc-90
  pour Bottom (isolate 0.61): 0,3.41 0,66.59 arc-90 3.41,70 202.59,70 arc-90 206,66.59 206,3.41 arc-90 202.59,0 3.41,0 arc-90
HV  (via drill 0.3 pad 0.8)
  Top 1.27: R50.2 arc90 161.06,32.51 v158.75,32.51 | R48.2 arc90 144.06,32.51 v141.73,32.51 | R46.2 arc90 110.06,32.51 v107.7,32.51 | R44.2 arc90 93.06,32.51 v90.81,32.51 | R42.2 arc90 59.06,32.51 v56.77,32.51 | R40.2 arc90 42.04,32.51 v39.75,32.51 | R13.2 76.05,39.22 v77.47,40.64 | R14.2 127.1,39.47 v128.27,40.64 | R51.2 29.06,51.92 27.94,50.8 D1.C 19.05,50.8 15.56,47.31 R2.2 10.16,43.18 C8.+
  Bottom 1.27: D1.C 22.86,43.35 33.7,32.51 v39.75,32.51 v56.77,32.51 82.55,32.51 | v158.75,32.51 v141.73,32.51 133.35,32.51 | 133.35,32.51 v107.7,32.51 v90.81,32.51 82.55,32.51 | v77.47,40.64 81.28,40.64 82.55,39.37 82.55,32.51 | v128.27,40.64 132.08,40.64 133.35,39.37 133.35,32.51
LED2
  Top 0.508: LED2.A 198.12,6.35 193.68,1.91 101.09,1.91 99.44,3.56 99.44,5.51 IC3.10
LED3
  Top 0.508: LED3.A 194.31,4.45 192.53,2.67 101.47,2.67 100.33,3.81 100.33,5.26 IC3.11
MISO  (via drill 0.35)
  Top 0.508: IC3.2 95.68,10.79 v95.63,10.79 | v94.73,8.38 96.63,6.48 v96.65,6.48
  Bottom 0.508: JP3.1 203.58,33.91 203.58,32.13 202.44,30.99 198.88,30.99 197.23,29.34 197.23,7.75 192.41,2.92 100.22,2.92 v96.65,6.48 | v95.63,10.79 94.74,9.91 94.74,8.39 v94.73,8.38
MOSI  (via drill 0.35)
  Top 0.508: v96.65,7.62 94.74,9.53 94.74,11.05 94.8,11.05 IC3.1
  Bottom 0.508: JP3.4 196.22,29.84 196.22,8.05 191.98,3.81 100.46,3.81 v96.65,7.62
N$23
  Top 1.27: SW1_PAD1.1 182.66,56.88 183.93,55.61 190.84,55.61 J1.1
N$24
  Top 1.016: R3.A 16.24,40.64 17.46,41.86 R2.1
N$25
  Top 0.813: IC2.3 5.71,31.37 6.1,30.99 8.26,30.99 C7.1
N$26
  Top 1.016: R3.E 16.92,35.56 17.46,35.02 R4.2
N$27  (via drill 0.35)
  Top 0.406: v102.36,8.26 102.49,8.38 104.93,8.38 IC3.14
  Bottom 0.305: Q2.3 102.36,9.29 v102.36,8.26
  Bottom 0.406: v102.36,8.26 104.27,6.35 C11.2
N$28
  Top 0.813: IC2.2 4.45,29.97 5.71,28.7 13.01,28.7 D14.C
  Top 1.016: Q1.1 12.79,23.9 R1.2 12.7,28.33 D14.C
N$29
  Top 2.54: 22.86,21.75 Q1.2 | D1.A 22.86,21.75 | L1.2 22.86,15.24 22.86,21.75
N$30
  Top 0.61: IC2.5 6.99,38.96 7.53,39.5 C6.1
  Top 0.813: C6.1 10.16,39.5 11.43,38.23 17.65,38.23 R3.S
N$36
  Top 0.508: R9.2 201.93,17.63 LED1.C
N$37
  Top 0.508: D13.C D4.C D5.C D6.C D7.C | D8.C D9.C D10.C D11.C D12.C
  Top 0.813: D8.C D7.C | R51.1 R52.2 31.88,57.17 C15.1 31.88,62.36 35.99,66.47 D13.C
N$38  (via drill 0.35)
  Top 0.406: v104.65,10.79 104.65,9.8 IC3.15
  Bottom 0.305: Q2.1 103.86,10.79 v104.65,10.79
  Bottom 0.406: v104.65,10.79 106.55,8.89 C12.2
N$39
  Top 0.61: Q3.1 177.8,31.26 177.94,31.11 U1.2
N$40
  Top 0.406: U1.1 178.7,34.02 175.17,34.02
  Top 0.508: C9.1 175.17,35.52 175.17,34.02 175.17,33.11 Q3.2
N$41
  Top 0.61: D2.2 C10.1 184.28,33.53 U1.8 186.58,32.38 187.61,31.35 187.61,30.68 D3.2
N$42
  Top 0.61: JP1.1 190.65,26.82 D3.1
N$43
  Top 0.508: N7.A 79.09,38.42 R13.1
N$44
  Top 0.508: N8.A 130.09,38.37 R14.1
N$45
  Top 0.508: R15.1 R16.2 T1.B
N$46
  Top 0.508: R17.1 R18.2 T2.B
N$47
  Top 0.508: R40.1 44.92,34.99 U2.P$6
N$48
  Top 0.508: R10.2 LED2.C
N$49
  Top 0.508: R11.2 194.31,17.63 LED3.C
N$50
  Top 0.508: R42.1 61.92,34.99 U3.P$6
N$51
  Top 0.508: R44.1 95.92,34.99 U4.P$6
N$52
  Top 0.508: R46.1 112.92,34.99 U5.P$6
N$53
  Top 0.508: R48.1 146.92,34.99 U6.P$6
N$54
  Top 0.508: R50.1 163.92,34.99 U7.P$6
N$55
  Top 0.508: R39.2 42.34,30.48 39.37,30.48 38.1,31.75 38.1,34.49 U2.P$1
N$56
  Top 0.508: R41.2 56.11,30.25 54.61,31.75 54.61,34.01 U3.P$1
N$57
  Top 0.508: R43.2 93.32,30.48 90.17,30.48 88.9,31.75 88.9,34.3 U4.P$1
N$58
  Top 0.508: R49.2 161.34,30.48 157.99,30.48 156.72,31.75 156.72,34.11 U7.P$1
N$59
  Top 0.508: R47.2 144.32,30.48 140.97,30.48 139.7,31.75 139.7,34.09 U6.P$1
N$60
  Top 0.508: R45.2 110.32,30.48 107.06,30.48 105.79,31.75 105.79,34.19 U5.P$1
N$61
  Top 0.508: T3.B R19.1
N$62
  Top 0.508: T4.B R21.1
N$63
  Top 0.508: T5.B R23.1
N$64
  Top 0.508: T6.B R25.1
N$65
  Top 0.508: T7.B R27.1
N$66
  Top 0.508: T8.B R29.1
N$67
  Top 0.508: T9.B R31.1
N$68
  Top 0.508: T10.B R33.1
N$69
  Top 0.508: T11.B R35.1
N$70
  Top 0.508: T12.B R37.1
RX  (via drill 0.3)
  Top 0.406: IC3.5 97.41,9.13 97.41,8.51 97.92,8 97.92,6.86 96.14,5.08 v87.63,5.08
  Bottom 0.406: RX.1 88.27,4.45 v87.63,5.08
SCK  (via drill 0.35)
  Top 0.508: IC3.3 96.18,10.16 v96.14,10.16
  Bottom 0.508: JP3.3 200.79,36.96 202.69,36.96 204.6,35.05 204.6,31.62 202.95,29.97 199.26,29.97 198.25,28.96 198.25,7.41 192.87,2.03 100.07,2.03 95.76,6.34 95.76,9.78 v96.14,10.16
SCL  (via drill 0.3)
  Top 0.508: U1.6 183.95,29.84 183.17,29.07 v183.17,25.4 183.17,22.03 R8.1 | IC3.24 111.84,17.91 v114.55,17.91
  Bottom 0.508: v114.55,17.91 116.2,19.56 157.99,19.56 163.83,25.4 v183.17,25.4
SDA  (via drill 0.3)
  Top 0.508: U1.5 185.2,28.35 v185.2,26.67 185.2,21.96 R7.1 | IC3.25 111.47,18.67 v113.79,18.67
  Bottom 0.508: v185.2,26.67 163.83,26.67 157.61,20.45 115.57,20.45 v113.79,18.67
SW1
  Top 0.508: S1.2 178.57,6.11 176.66,4.19 107.99,4.19 IC3.13
SW2
  Top 0.508: S2.2 188.73,6.23 185.93,3.43 107.62,3.43 IC3.12
TX  (via drill 0.3)
  Top 0.406: v87.63,2.92 95,2.92 98.55,6.48 98.55,6.49 98.58,6.51 98.58,8.04 IC3.7
  Bottom 0.406: TX.1 88.14,2.41 v87.63,2.92

### Text on the board
tPlace: PWR 12V / DC | ISP | ISP | MISO | VCC 5V | SCK | MOSI | !RST | GND | RTC EX_PWR | +BAT | RTC PWR | - BAT | 2V..6V | A | B | PWR | NIXIE_CLOCK V1.0 | SELECT | SET | EX_DEVICES | VCC 5V | VCC 5V | GND | GND | RX | 1_WIRE | TX | Wymiary PCB: / 206mm x 70mm / / Rozstaw otworów montażowych: / 198mm x 62mm | Zasilanie zegara: 12V 1A DC | Zasilanie zewnętrzne RTC: bateria 2V do 6V | Za pomocą R3 ustawić odpowiedznie napięcie dla lamp nixie | Paweł Zięba / 21.03.2020